# Altium project T1_Card.PrjPcb (part 5 of 6)

## Sheet T1_Data_Top_Level.SchDoc
size 431 x 279 mm; Date: Not shown in title block; ApprovedBy: Not shown in title block; CheckedBy: Not shown in title block; Author: Not shown in title block; CompanyName: Not shown in title block; DrawnBy: Andy Lin (TI); Engineer: Not shown in title block; Organization: Not shown in title block; Address1: Not shown in title block; Address2: Not shown in title block; Address3: Not shown in title block; Address4: Not shown in title block; DocumentNumber: 12; Revision: Use project parameter SCH_Rev; SheetNumber: 12; SheetTotal: 14; PageSetup: Record=PageOptions|CenterHorizontal=True|CenterVertical=True|PrintScale=1.00|XCorrection=1.00|YCorrection=1.00|PrintKind=0|BorderSize=5000000|LeftOffset=0|BottomOffset=0|Orientation=2|PaperLength=1000|PaperWidth=1000|Scale=100|PaperSource=15|PrintQuality=600|MediaType=1|DitherType=10|PaperKind=Letter|PrintScaleMode=1; CurrentTime: Not shown in title block; CurrentDate: Not shown in title block; Time: Not shown in title block; DocumentFullPathAndName: Not shown in title block; DocumentName: Not shown in title block; ModifiedDate: Not shown in title block; ImagePath: Not shown in title block
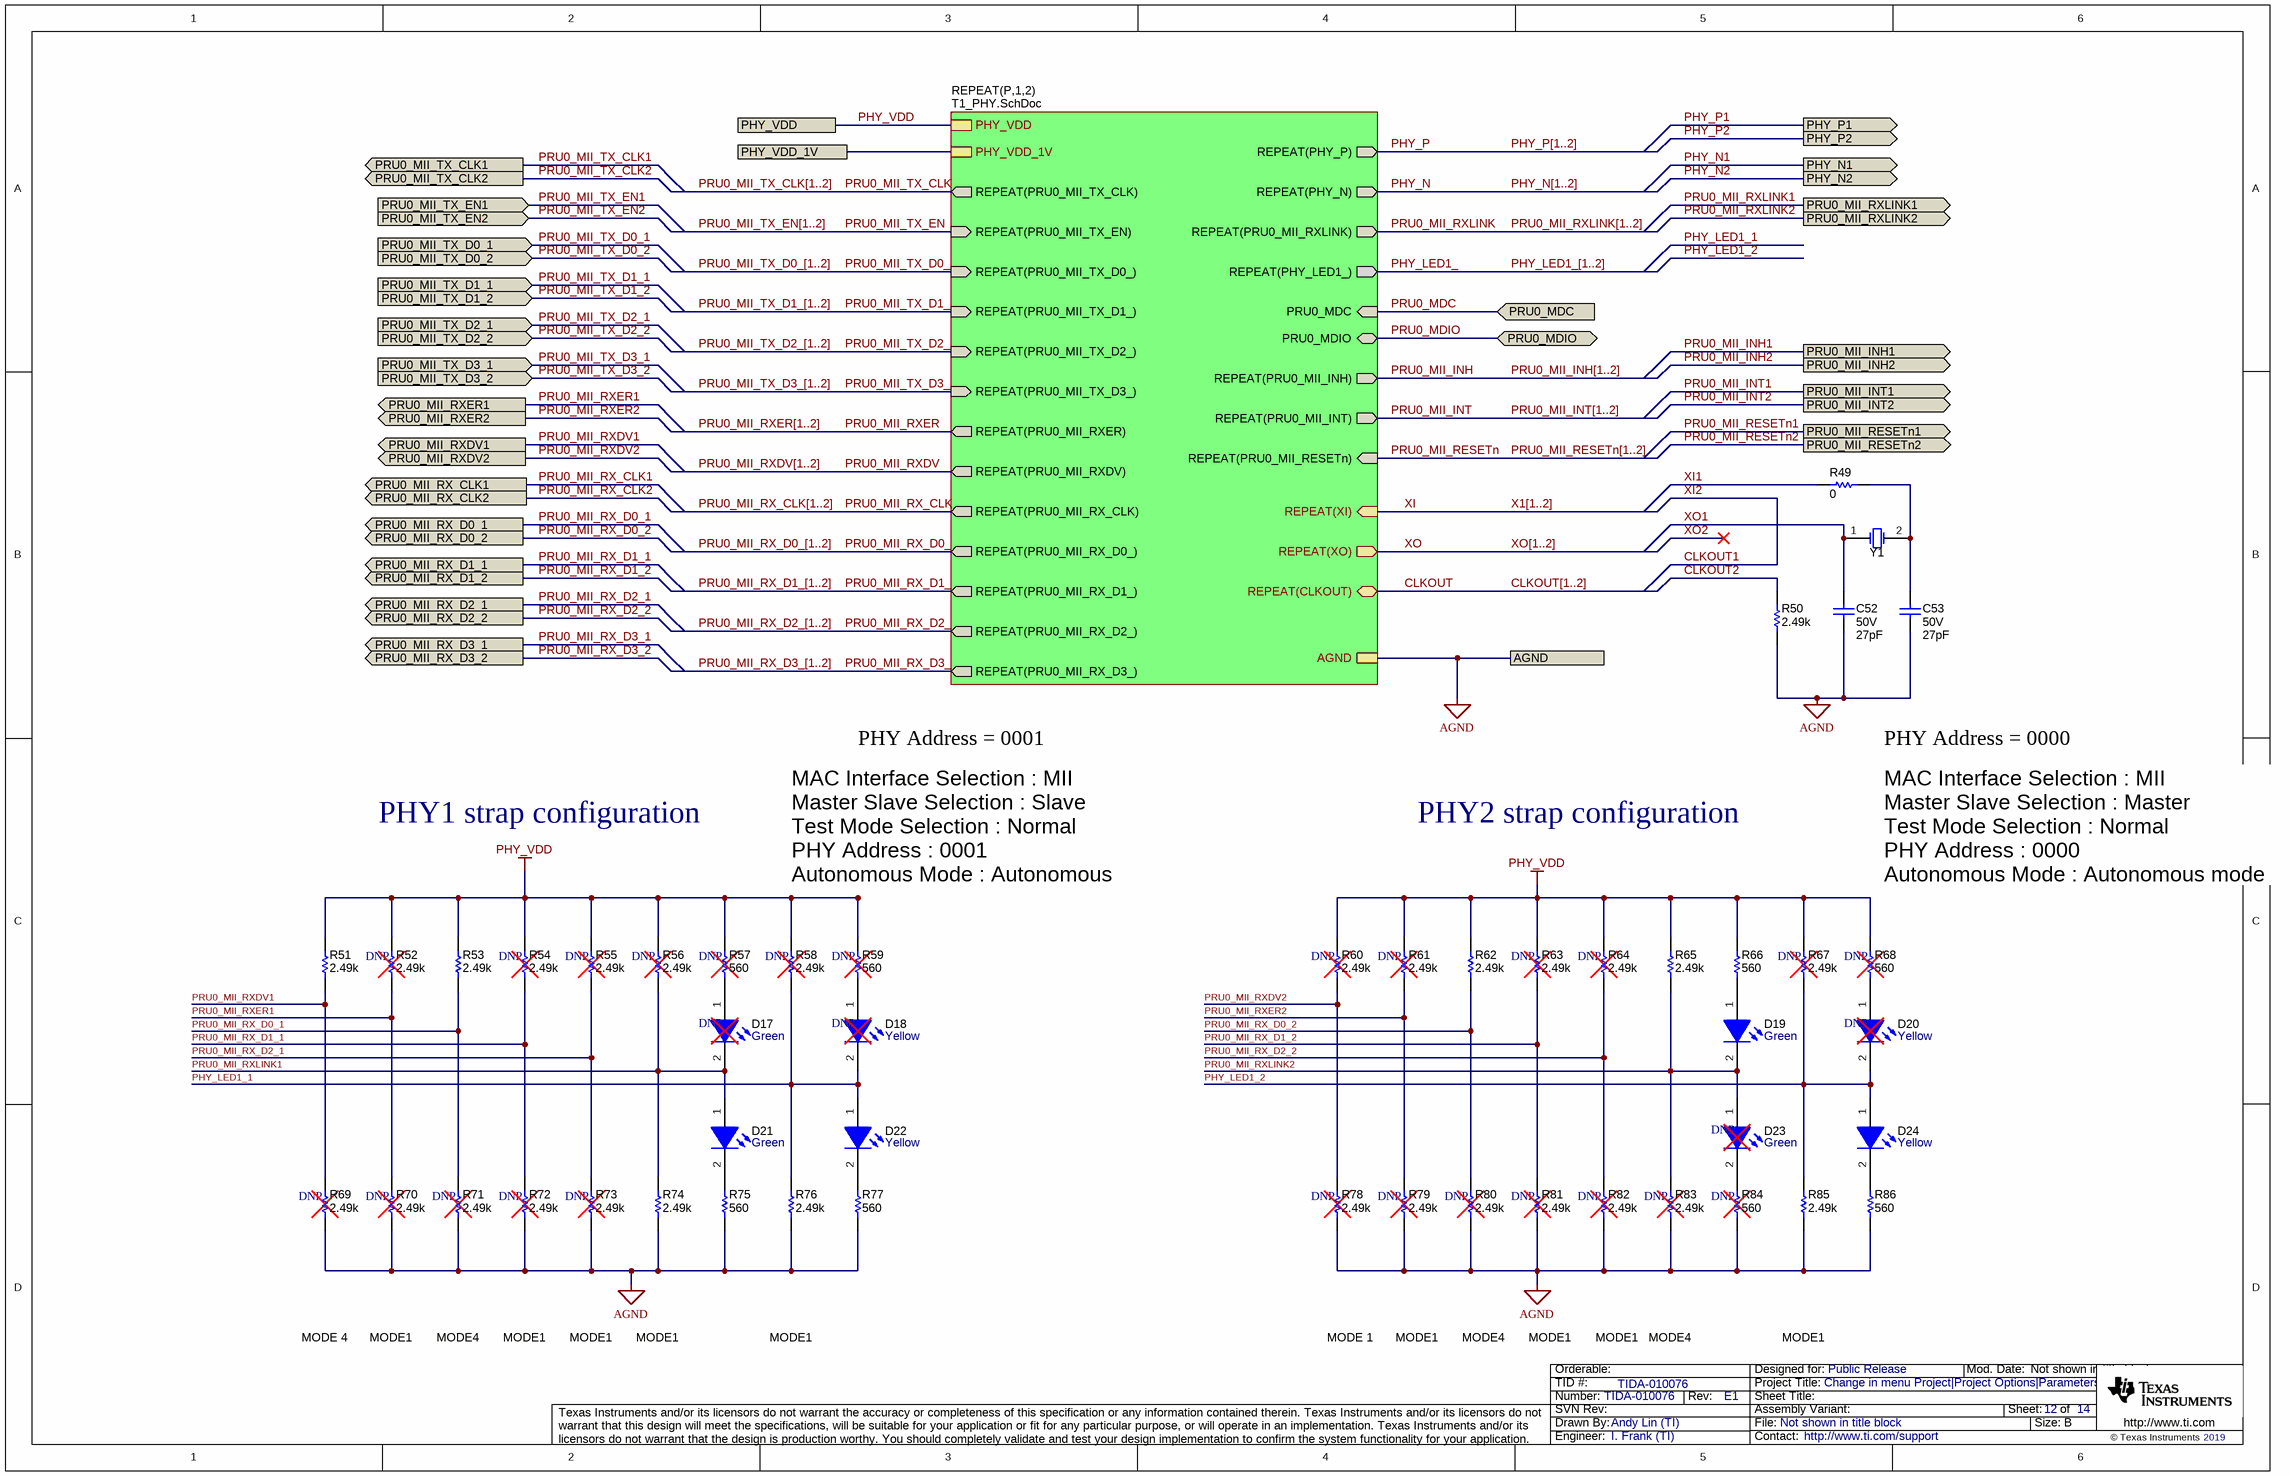
[diagram p11: T1_Data_Top_Level.SchDoc]

### Parts
C52  VDC_V: 50V  ValueDisplayed: 27pF  [0603]  (hidden comment: GRM1885C1H270JA01D)
C53  VDC_V: 50V  ValueDisplayed: 27pF  [0603]  (hidden comment: GRM1885C1H270JA01D)
D17  value Green  [LG L29K_GREEN]  (hidden comment: LG L29K-G2J1-24-Z)
D18  value Yellow  [LY L29K_Yellow]  (hidden comment: LY L29K-J1K2-26-Z)
D19  value Green  [LG L29K_GREEN]  (hidden comment: LG L29K-G2J1-24-Z)
D20  value Yellow  [LY L29K_Yellow]  (hidden comment: LY L29K-J1K2-26-Z)
D21  value Green  [LG L29K_GREEN]  (hidden comment: LG L29K-G2J1-24-Z)
D22  value Yellow  [LY L29K_Yellow]  (hidden comment: LY L29K-J1K2-26-Z)
D23  value Green  [LG L29K_GREEN]  (hidden comment: LG L29K-G2J1-24-Z)
D24  value Yellow  [LY L29K_Yellow]  (hidden comment: LY L29K-J1K2-26-Z)
R49  ValueDisplayed: 0  [0402]  (hidden comment: CRCW04020000Z0ED)
R50  ValueDisplayed: 2.49k  [0402]  (hidden comment: CRCW04022K49FKED)
R51  ValueDisplayed: 2.49k  [0402]  (hidden comment: CRCW04022K49FKED)
R52  ValueDisplayed: 2.49k  [0402]  (hidden comment: CRCW04022K49FKED)
R53  ValueDisplayed: 2.49k  [0402]  (hidden comment: CRCW04022K49FKED)
R54  ValueDisplayed: 2.49k  [0402]  (hidden comment: CRCW04022K49FKED)
R55  ValueDisplayed: 2.49k  [0402]  (hidden comment: CRCW04022K49FKED)
R56  ValueDisplayed: 2.49k  [0402]  (hidden comment: CRCW04022K49FKED)
R57  ValueDisplayed: 560  [0402]  (hidden comment: CRCW0402560RJNED)
R58  ValueDisplayed: 2.49k  [0402]  (hidden comment: CRCW04022K49FKED)
R59  ValueDisplayed: 560  [0402]  (hidden comment: CRCW0402560RJNED)
R60  ValueDisplayed: 2.49k  [0402]  (hidden comment: CRCW04022K49FKED)
R61  ValueDisplayed: 2.49k  [0402]  (hidden comment: CRCW04022K49FKED)
R62  ValueDisplayed: 2.49k  [0402]  (hidden comment: CRCW04022K49FKED)
R63  ValueDisplayed: 2.49k  [0402]  (hidden comment: CRCW04022K49FKED)
R64  ValueDisplayed: 2.49k  [0402]  (hidden comment: CRCW04022K49FKED)
R65  ValueDisplayed: 2.49k  [0402]  (hidden comment: CRCW04022K49FKED)
R66  ValueDisplayed: 560  [0402]  (hidden comment: CRCW0402560RJNED)
R67  ValueDisplayed: 2.49k  [0402]  (hidden comment: CRCW04022K49FKED)
R68  ValueDisplayed: 560  [0402]  (hidden comment: CRCW0402560RJNED)
R69  ValueDisplayed: 2.49k  [0402]  (hidden comment: CRCW04022K49FKED)
R70  ValueDisplayed: 2.49k  [0402]  (hidden comment: CRCW04022K49FKED)
R71  ValueDisplayed: 2.49k  [0402]  (hidden comment: CRCW04022K49FKED)
R72  ValueDisplayed: 2.49k  [0402]  (hidden comment: CRCW04022K49FKED)
R73  ValueDisplayed: 2.49k  [0402]  (hidden comment: CRCW04022K49FKED)
R74  ValueDisplayed: 2.49k  [0402]  (hidden comment: CRCW04022K49FKED)
R75  ValueDisplayed: 560  [0402]  (hidden comment: CRCW0402560RJNED)
R76  ValueDisplayed: 2.49k  [0402]  (hidden comment: CRCW04022K49FKED)
R77  ValueDisplayed: 560  [0402]  (hidden comment: CRCW0402560RJNED)
R78  ValueDisplayed: 2.49k  [0402]  (hidden comment: CRCW04022K49FKED)
R79  ValueDisplayed: 2.49k  [0402]  (hidden comment: CRCW04022K49FKED)
R80  ValueDisplayed: 2.49k  [0402]  (hidden comment: CRCW04022K49FKED)
R81  ValueDisplayed: 2.49k  [0402]  (hidden comment: CRCW04022K49FKED)
R82  ValueDisplayed: 2.49k  [0402]  (hidden comment: CRCW04022K49FKED)
R83  ValueDisplayed: 2.49k  [0402]  (hidden comment: CRCW04022K49FKED)
R84  ValueDisplayed: 560  [0402]  (hidden comment: CRCW0402560RJNED)
R85  ValueDisplayed: 2.49k  [0402]  (hidden comment: CRCW04022K49FKED)
R86  ValueDisplayed: 560  [0402]  (hidden comment: CRCW0402560RJNED)
Y1  ABM3-25.000MHZ-D2Y-T  [XTAL_ABM3]  (value not drawn)

### Sub-sheets
REPEAT(P,1,2) = T1_PHY.SchDoc: REPEAT(PRU0_MII_INH) (out), REPEAT(PRU0_MII_INT) (out), REPEAT(PRU0_MII_RESETn) (in), REPEAT(PRU0_MII_TX_CLK) (out), REPEAT(PRU0_MII_TX_EN) (in), REPEAT(PRU0_MII_TX_D0_) (in), REPEAT(PRU0_MII_TX_D1_) (in), REPEAT(PRU0_MII_TX_D2_) (in), REPEAT(PRU0_MII_TX_D3_) (in), REPEAT(PRU0_MII_RX_D0_) (out), REPEAT(PRU0_MII_RX_D1_) (out), REPEAT(PRU0_MII_RX_D2_) (out), REPEAT(PRU0_MII_RX_D3_) (out), REPEAT(PRU0_MII_RXER) (out), REPEAT(PRU0_MII_RXDV) (out), REPEAT(PRU0_MII_RX_CLK) (out), REPEAT(PRU0_MII_RXLINK) (out), PRU0_MDIO (bidir), PRU0_MDC (in), REPEAT(PHY_P) (out), REPEAT(PHY_N) (out), REPEAT(PHY_LED1_) (out), AGND, PHY_VDD, REPEAT(XO) (out), REPEAT(XI) (in), REPEAT(CLKOUT) (bidir), PHY_VDD_1V

### Ports
AGND, PHY_N1 (out), PHY_N2 (out), PHY_P1 (out), PHY_P2 (out), PHY_VDD, PHY_VDD_1V, PRU0_MDC (in), PRU0_MDIO (bidir), PRU0_MII_INH1 (out), PRU0_MII_INH2 (out), PRU0_MII_INT1 (out), PRU0_MII_INT2 (out), PRU0_MII_RESETn1 (out), PRU0_MII_RESETn2 (out), PRU0_MII_RX_CLK1 (out), PRU0_MII_RX_CLK2 (out), PRU0_MII_RX_D0_1 (out), PRU0_MII_RX_D0_2 (out), PRU0_MII_RX_D1_1 (out), PRU0_MII_RX_D1_2 (out), PRU0_MII_RX_D2_1 (out), PRU0_MII_RX_D2_2 (out), PRU0_MII_RX_D3_1 (out), PRU0_MII_RX_D3_2 (out), PRU0_MII_RXDV1 (out), PRU0_MII_RXDV2 (out), PRU0_MII_RXER1 (out), PRU0_MII_RXER2 (out), PRU0_MII_RXLINK1 (out), PRU0_MII_RXLINK2 (out), PRU0_MII_TX_CLK1 (out), PRU0_MII_TX_CLK2 (out), PRU0_MII_TX_D0_1 (in), PRU0_MII_TX_D0_2 (in), PRU0_MII_TX_D1_1 (in), PRU0_MII_TX_D1_2 (in), PRU0_MII_TX_D2_1 (in), PRU0_MII_TX_D2_2 (in), PRU0_MII_TX_D3_1 (in), PRU0_MII_TX_D3_2 (in), PRU0_MII_TX_EN1 (in), PRU0_MII_TX_EN2 (in)

### Nets
AGND: C52.2 C53.2 R50.1 R69.1 R70.1 R71.1 R72.1 R73.1 R74.1 R75.1 R76.1 R77.1 R78.1 R79.1 R80.1 R81.1 R82.1 R83.1 R84.1 R85.1 R86.1 ; port AGND, sheet REPEAT(P,1,2)/AGND
PHY_VDD: R51.2 R52.2 R53.2 R54.2 R55.2 R56.2 R57.2 R58.2 R59.2 R60.2 R61.2 R62.2 R63.2 R64.2 R65.2 R66.2 R67.2 R68.2 ; port PHY_VDD, sheet REPEAT(P,1,2)/PHY_VDD
CLKOUT: sheet REPEAT(P,1,2)/REPEAT(CLKOUT)
CLKOUT2: R50.2
PHY_LED1_: sheet REPEAT(P,1,2)/REPEAT(PHY_LED1_)
PHY_LED1_1: D18.2(K) D22.1(A) R58.1 R76.2
PHY_LED1_2: D20.2(K) D24.1(A) R67.1 R85.2
PHY_N: sheet REPEAT(P,1,2)/REPEAT(PHY_N)
PHY_N1: port PHY_N1
PHY_N2: port PHY_N2
PHY_P: sheet REPEAT(P,1,2)/REPEAT(PHY_P)
PHY_P1: port PHY_P1
PHY_P2: port PHY_P2
PHY_VDD_1V: port PHY_VDD_1V, sheet REPEAT(P,1,2)/PHY_VDD_1V
PRU0_MDC: port PRU0_MDC, sheet REPEAT(P,1,2)/PRU0_MDC
PRU0_MDIO: port PRU0_MDIO, sheet REPEAT(P,1,2)/PRU0_MDIO
PRU0_MII_INH: sheet REPEAT(P,1,2)/REPEAT(PRU0_MII_INH)
PRU0_MII_INH1: port PRU0_MII_INH1
PRU0_MII_INH2: port PRU0_MII_INH2
PRU0_MII_INT: sheet REPEAT(P,1,2)/REPEAT(PRU0_MII_INT)
PRU0_MII_INT1: port PRU0_MII_INT1
PRU0_MII_INT2: port PRU0_MII_INT2
PRU0_MII_RESETn: sheet REPEAT(P,1,2)/REPEAT(PRU0_MII_RESETn)
PRU0_MII_RESETn1: port PRU0_MII_RESETn1
PRU0_MII_RESETn2: port PRU0_MII_RESETn2
PRU0_MII_RX_CLK: sheet REPEAT(P,1,2)/REPEAT(PRU0_MII_RX_CLK)
PRU0_MII_RX_CLK1: port PRU0_MII_RX_CLK1
PRU0_MII_RX_CLK2: port PRU0_MII_RX_CLK2
PRU0_MII_RX_D0_: sheet REPEAT(P,1,2)/REPEAT(PRU0_MII_RX_D0_)
PRU0_MII_RX_D0_1: R53.1 R71.2 ; port PRU0_MII_RX_D0_1
PRU0_MII_RX_D0_2: R62.1 R80.2 ; port PRU0_MII_RX_D0_2
PRU0_MII_RX_D1_: sheet REPEAT(P,1,2)/REPEAT(PRU0_MII_RX_D1_)
PRU0_MII_RX_D1_1: R54.1 R72.2 ; port PRU0_MII_RX_D1_1
PRU0_MII_RX_D1_2: R63.1 R81.2 ; port PRU0_MII_RX_D1_2
PRU0_MII_RX_D2_: sheet REPEAT(P,1,2)/REPEAT(PRU0_MII_RX_D2_)
PRU0_MII_RX_D2_1: R55.1 R73.2 ; port PRU0_MII_RX_D2_1
PRU0_MII_RX_D2_2: R64.1 R82.2 ; port PRU0_MII_RX_D2_2
PRU0_MII_RX_D3_: sheet REPEAT(P,1,2)/REPEAT(PRU0_MII_RX_D3_)
PRU0_MII_RX_D3_1: port PRU0_MII_RX_D3_1
PRU0_MII_RX_D3_2: port PRU0_MII_RX_D3_2
PRU0_MII_RXDV: sheet REPEAT(P,1,2)/REPEAT(PRU0_MII_RXDV)
PRU0_MII_RXDV1: R51.1 R69.2 ; port PRU0_MII_RXDV1
PRU0_MII_RXDV2: R60.1 R78.2 ; port PRU0_MII_RXDV2
PRU0_MII_RXER: sheet REPEAT(P,1,2)/REPEAT(PRU0_MII_RXER)
PRU0_MII_RXER1: R52.1 R70.2 ; port PRU0_MII_RXER1
PRU0_MII_RXER2: R61.1 R79.2 ; port PRU0_MII_RXER2
PRU0_MII_RXLINK: sheet REPEAT(P,1,2)/REPEAT(PRU0_MII_RXLINK)
PRU0_MII_RXLINK1: D17.2(K) D21.1(A) R56.1 R74.2 ; port PRU0_MII_RXLINK1
PRU0_MII_RXLINK2: D19.2(K) D23.1(A) R65.1 R83.2 ; port PRU0_MII_RXLINK2
PRU0_MII_TX_CLK: sheet REPEAT(P,1,2)/REPEAT(PRU0_MII_TX_CLK)
PRU0_MII_TX_CLK1: port PRU0_MII_TX_CLK1
PRU0_MII_TX_CLK2: port PRU0_MII_TX_CLK2
PRU0_MII_TX_D0_: sheet REPEAT(P,1,2)/REPEAT(PRU0_MII_TX_D0_)
PRU0_MII_TX_D0_1: port PRU0_MII_TX_D0_1
PRU0_MII_TX_D0_2: port PRU0_MII_TX_D0_2
PRU0_MII_TX_D1_: sheet REPEAT(P,1,2)/REPEAT(PRU0_MII_TX_D1_)
PRU0_MII_TX_D1_1: port PRU0_MII_TX_D1_1
PRU0_MII_TX_D1_2: port PRU0_MII_TX_D1_2
PRU0_MII_TX_D2_: sheet REPEAT(P,1,2)/REPEAT(PRU0_MII_TX_D2_)
PRU0_MII_TX_D2_1: port PRU0_MII_TX_D2_1
PRU0_MII_TX_D2_2: port PRU0_MII_TX_D2_2
PRU0_MII_TX_D3_: sheet REPEAT(P,1,2)/REPEAT(PRU0_MII_TX_D3_)
PRU0_MII_TX_D3_1: port PRU0_MII_TX_D3_1
PRU0_MII_TX_D3_2: port PRU0_MII_TX_D3_2
PRU0_MII_TX_EN: sheet REPEAT(P,1,2)/REPEAT(PRU0_MII_TX_EN)
PRU0_MII_TX_EN1: port PRU0_MII_TX_EN1
PRU0_MII_TX_EN2: port PRU0_MII_TX_EN2
XI: sheet REPEAT(P,1,2)/REPEAT(XI)
XI1: R49.1
XO: sheet REPEAT(P,1,2)/REPEAT(XO)
XO1: C52.1 Y1.1(OSC1)
NetC53_1: C53.1 R49.2 Y1.2(OSC2)
NetD17_1: D17.1(A) R57.1
NetD18_1: D18.1(A) R59.1
NetD19_1: D19.1(A) R66.1
NetD20_1: D20.1(A) R68.1
NetD21_2: D21.2(K) R75.2
NetD22_2: D22.2(K) R77.2
NetD23_2: D23.2(K) R84.2
NetD24_2: D24.2(K) R86.2

### Buses and harness runs
bus CLKOUT[1..2]
bus PHY_LED1_[1..2]
bus PHY_N[1..2]
bus PHY_P[1..2]
bus PRU0_MII_INH[1..2]
bus PRU0_MII_INT[1..2]
bus PRU0_MII_RESETn[1..2]
bus PRU0_MII_RX_CLK[1..2]
bus PRU0_MII_RX_D0_[1..2]
bus PRU0_MII_RX_D1_[1..2]
bus PRU0_MII_RX_D2_[1..2]
bus PRU0_MII_RX_D3_[1..2]
bus PRU0_MII_RXDV[1..2]
bus PRU0_MII_RXER[1..2]
bus PRU0_MII_RXLINK[1..2]
bus PRU0_MII_TX_CLK[1..2]
bus PRU0_MII_TX_D0_[1..2]
bus PRU0_MII_TX_D1_[1..2]
bus PRU0_MII_TX_D2_[1..2]
bus PRU0_MII_TX_D3_[1..2]
bus PRU0_MII_TX_EN[1..2]
bus X1[1..2]
bus XO[1..2]

### Notes on the sheet
- PHY1 strap configuration
- PHY2 strap configuration
- MAC Interface Selection : MII
  Master Slave Selection : Slave
  Test Mode Selection : Normal
  PHY Address : 0001
  Autonomous Mode : Autonomous mode
- MAC Interface Selection : MII
  Master Slave Selection : Master
  Test Mode Selection : Normal
  PHY Address : 0000
  Autonomous Mode : Autonomous mode
- (near R52) DNP
- (near R54) DNP
- (near R55) DNP
- (near R56) DNP
- (near R57) DNP
- (near R58) DNP
- (near R59) DNP
- (near R60) DNP
- (near R61) DNP
- (near R63) DNP
- (near R64) DNP
- (near R67) DNP
- (near R68) DNP
- (near D17) DNP
- (near D18) DNP
- (near D20) DNP
- (near D23) DNP
- (near R69) DNP
- (near R70) DNP
- (near R71) DNP
- (near R72) DNP
- (near R73) DNP
- (near R78) DNP
- (near R79) DNP
- (near R80) DNP
- (near R81) DNP
- (near R82) DNP
- (near R83) DNP
- (near R84) DNP
- MODE 4
- MODE1
- MODE4
- MODE 1
- Labels drawn without touching a wire or pin: PHY Address = 0000, PHY Address = 0001
- Drawn By:
- SVN Rev:
- Number:
- TID #:
- Orderable:
- Rev:
- Sheet Title:
- File:
- Project Title:
- Designed for:
- Assembly Variant:
- Mod. Date:
- Sheet:
- Size:
- of
- B
- http://www.ti.com
- Texas Instruments and/or its licensors do not warrant the accuracy or completeness of this specification or any information contained therein. Texas Instruments and/or its licensors do not warrant that this design will meet the specifications, will be suitable for your application or fit for any particular purpose, or will operate in an implementation. Texas Instruments and/or its licensors do not warrant that the design is production worthy. You should completely validate and test your design implementation to confirm the system functionality for your application.
- Engineer:
- Contact:
- © Texas Instruments

### Library data of the parts
C52 C53 = CMP-0007202-4: CAP, CERM, 27 pF, 50 V, +/- 5%, C0G/NP0, 0603; Manufacturer: MuRata; TaMin_C: -55°C; Polarized: N; SizeAreaWB_mm2: 4.68; Value1: Unknown; U/M: EA; Value: 27pF; TaMax_C: 125°C; SizeZ_mm: 1; SizeX_mm: 1.6; SizeY_mm: 0.8; SizeArea_mm2: 1.28; AEC Category: Q200; Supplier Part Number 2: 81-GRM1885C1H270JA01; Publisher: Texas Instruments; Supplier 2: Mouser; Supplier Part Number 3: 1828909; TempCo: C0G/NP0; Supplier 3: Farnell; Published: 2008-06-19; RoHS: Y; MountType: SMT; Supplier 1: Digi-Key; PackageReference: 0603; Tolerance_%: 5%; Cap_Case: 0603; Value2: 50V; CompType: Capacitor; LatestRevisionDate: 2017-03-09; PartNumber: GRM1885C1H270JA01D; AEC Qualified: ?; Cap_F: 27pF; ComponentLink1Description: Datasheet link; Supplier Part Number 1: 490-1413-1-ND; Technology: Ceramic; ComponentLink1URL: http://search.murata.co.jp/Ceramy/PnsearchViewAction.do?HnOFG=ON&HnNFG=ON&SEL_CNT=50&sLang=en&sKey=GRM1885C1H270JA01D&x=9&y=9&search=startwith
D17 D19 D21 D23 = CMP-0002874-2: LED, Green, SMD; Manufacturer: OSRAM; Io_A: 2mA; Value2: 1.7V; Value1: W; Tjmax_C: 110°C; RoHS: Y; PartNumber: LG L29K-G2J1-24-Z; Color: green; Type: ?; PackageReference: 1.7x0.65x0.8mm; ComponentLink1URL: http://www.osram-os.com/Graphics/XPic2/00077107_0.pdf; ComponentLink1Description: Datasheet link; Vf_V: 1.7V; CompType: LED; MountType: SMT
D18 D20 D22 D24 = CMP-0002875-2: LED, Yellow, SMD; Manufacturer: OSRAM; Tjmax_C: 110°C; Value1: W; Value2: 1.8V; Io_A: 2mA; RoHS: Y; PackageReference: LED, 1.3x0.65x0.8mm; ComponentLink1URL: http://www.osram-os.com/Graphics/XPic1/00077106_0.pdf/LY%20%20%20%20%20%20L29K%20-%20SMARTLED%200603.pdf; CompType: LED; PartNumber: LY L29K-J1K2-26-Z; Color: yellow; Type: ?; Vf_V: 1.8V; ComponentLink1Description: Datasheet link; MountType: SMT
R49 = CMP-0026822-2: RES, 0, 5%, 0.063 W, 0402; Manufacturer: Vishay-Dale; Power_W: 63mW; TempCo: 200 ppm/C; Value_Code: 0000; U/M: EA; Value: 0; EIA_Code: E24; SizeX_mm: 1; SizeY_mm: 0.5; SizeZ_mm: 0.6; Value2: 0.063W; VDC_V: 50V; AEC Category: Q200; Supplier Part Number 2: 52K6543; Publisher: Texas Instruments; Supplier 2: Newark; Supplier Part Number 3: 71-CRCW0402-0-E3; Supplier 3: Mouser; Published: 2008-06-26; RoHS: Y; Value1: 5%; MountType: SMT; Supplier 1: Digi-Key; PackageReference: 0402; Tolerance_%: 5%; Res_ohm: 0; SizeArea_mm2: 0.5; CompType: Resistor; LatestRevisionDate: 2017-03-09; PartNumber: CRCW04020000Z0ED; AEC Qualified: ?; ComponentLink1Description: Datasheet link; Supplier Part Number 1: 541-0.0JCT-ND; Technology: Thick Film; ComponentLink1URL: http://www.vishay.com/docs/20035/dcrcwe3.pdf
R50-R56 R58 R60-R65 R67 R69-R74 R76 R78-R83 R85 = CMP-0026237-2: RES, 2.49 k, 1%, 0.063 W, AEC-Q200 Grade 0, 0402; Manufacturer: Vishay-Dale; Power_W: 63mW; TempCo: 100 ppm/C; Value_Code: 2k49; Value: 2.49k; EIA_Code: E96; SizeX_mm: 1; SizeY_mm: 0.5; SizeZ_mm: 0.6; Value2: 0.063W; AEC Qualified: Y; VDC_V: 50V; AEC Category: Q200; AEC Grade: 0; ComponentLink1URL: http://www.vishay.com/docs/20035/dcrcwe3.pdf; Supplier Part Number 2: 52K6803; Supplier 2: Newark; Supplier Part Number 3: 71-CRCW0402-2.49K-E3; Supplier 3: Mouser; RoHS: E; Value1: 1%; MountType: SMT; Supplier 1: Digi-Key; PackageReference: 0402; Tolerance_%: 1%; Res_ohm: 2.49k; SizeArea_mm2: 0.5; CompType: Resistor; PartNumber: CRCW04022K49FKED; ComponentLink1Description: Datasheet link; Supplier Part Number 1: 541-2.49KLCT-ND; Technology: Thick Film
R57 R59 R66 R68 R75 R77 R84 R86 = CMP-0026948-3: RES, 560, 5%, 0.063 W, AEC-Q200 Grade 0, 0402; Manufacturer: Vishay-Dale; Power_W: 63mW; TempCo: 200 ppm/C; Value_Code: 560R; Value: 560; EIA_Code: E24; SizeX_mm: 1; SizeY_mm: 0.5; SizeZ_mm: 0.6; Value2: 0.063W; AEC Qualified: Y; VDC_V: 50V; AEC Category: Q200; AEC Grade: 0; Supplier Part Number 2: 59M6740; Supplier 2: Newark; Supplier Part Number 3: 71-CRCW0402J-560-E3; Supplier 3: Mouser; RoHS: E; Value1: 5%; MountType: SMT; Supplier 1: Digi-Key; PackageReference: 0402; Tolerance_%: 5%; Res_ohm: 560; SizeArea_mm2: 0.5; CompType: Resistor; PartNumber: CRCW0402560RJNED; ComponentLink1Description: Datasheet link; Supplier Part Number 1: 541-560JCT-ND; Technology: Thick Film; ComponentLink1URL: http://www.vishay.com/docs/20035/dcrcwe3.pdf
Y1 = CMP-0004620-3: Crystal, 25 MHz, 18 pF, SMD; Manufacturer: Abracon Corporation; TaMin_C: -40°C; Frequency Stability: +/-30ppm; Frequency_Fixed: 25MHz; TaMax_C: 85°C; Supplier Part Number 2: 77R1477; Supplier 2: Newark; Supplier Part Number 3: 815-ABM3-25-D2Y-T; Supplier 3: Mouser; RoHS: E; MountType: SMT; Supplier 1: Digi-Key; PackageReference: ABM3; CompType: Crystal; PartNumber: ABM3-25.000MHZ-D2Y-T; ComponentLink1Description: Datasheet Link; Supplier Part Number 1: 535-10645-1-ND; ComponentLink1URL: http://www.abracon.com/Resonators/abm3.pdf; REACh: Y

## Sheet T1_PHY.SchDoc
size 431 x 279 mm; Date: Not shown in title block; ApprovedBy: Not shown in title block; CheckedBy: Not shown in title block; Author: Not shown in title block; CompanyName: Not shown in title block; DrawnBy: Andy Lin (TI); Engineer: Not shown in title block; Organization: Not shown in title block; Address1: Not shown in title block; Address2: Not shown in title block; Address3: Not shown in title block; Address4: Not shown in title block; DocumentNumber: 13; Revision: Use project parameter SCH_Rev; SheetNumber: 13; SheetTotal: 14; PageSetup: Record=PageOptions|CenterHorizontal=True|CenterVertical=True|PrintScale=1.00|XCorrection=1.00|YCorrection=1.00|PrintKind=0|BorderSize=5000000|LeftOffset=0|BottomOffset=0|Orientation=2|PaperLength=1000|PaperWidth=1000|Scale=100|PaperSource=15|PrintQuality=600|MediaType=1|DitherType=10|PaperKind=Letter|PrintScaleMode=1; CurrentTime: Not shown in title block; CurrentDate: Not shown in title block; Time: Not shown in title block; DocumentFullPathAndName: Not shown in title block; DocumentName: Not shown in title block; ModifiedDate: Not shown in title block; ImagePath: Not shown in title block
Used 2 times, as channels U_T1_Card_Top/U_T1_Data_Top_Level/P1, U_T1_Card_Top/U_T1_Data_Top_Level/P2. Parts and nets are listed once, with the designators drawn on the sheet.
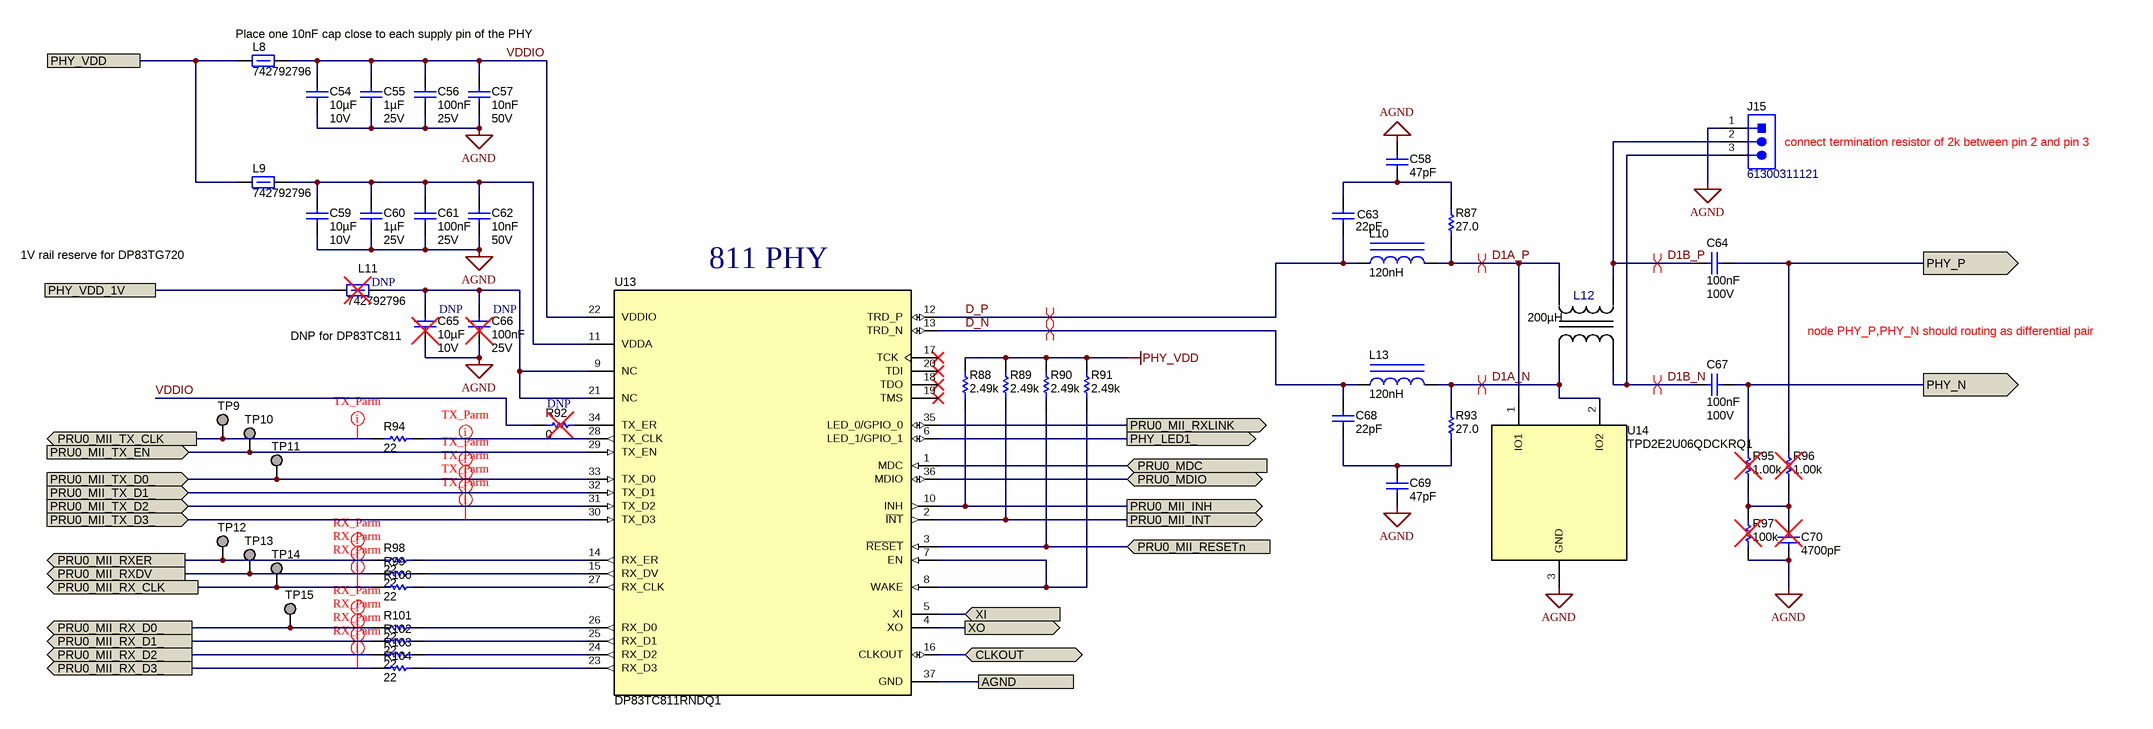
[diagram p12: T1_PHY.SchDoc]

### Parts
C54  Cap_F: 10µF  VDC_V: 10V  [0603]  (hidden comment: GRM188Z71A106MA73D)
C55  Cap_F: 1µF  VDC_V: 25V  [0603]  (hidden comment: GCM188R71E105KA64D)
C56  Cap_F: 100nF  VDC_V: 25V  [0603]  (hidden comment: GRM188R71E104KA01D)
C57  Cap_F: 10nF  VDC_V: 50V  [0603]  (hidden comment: GCM188R71H103KA37D)
C58  ValueDisplayed: 47pF  [0603]  (hidden comment: CGA3E2C0G1H470J080AA)
C59  Cap_F: 10µF  VDC_V: 10V  [0603]  (hidden comment: GRM188Z71A106MA73D)
C60  Cap_F: 1µF  VDC_V: 25V  [0603]  (hidden comment: GCM188R71E105KA64D)
C61  Cap_F: 100nF  VDC_V: 25V  [0603]  (hidden comment: GRM188R71E104KA01D)
C62  Cap_F: 10nF  VDC_V: 50V  [0603]  (hidden comment: GCM188R71H103KA37D)
C63  ValueDisplayed: 22pF  [0603]  (hidden comment: GRM1885C2A220JA01D)
C64  Cap_F: 100nF  VDC_V: 100V  [0603]  (hidden comment: GRM188R72A104KA35J)
C65  Cap_F: 10µF  VDC_V: 10V  [0603]  (hidden comment: GRM188Z71A106MA73D)
C66  Cap_F: 100nF  VDC_V: 25V  [0603]  (hidden comment: GRM188R71E104KA01D)
C67  Cap_F: 100nF  VDC_V: 100V  [0603]  (hidden comment: GRM188R72A104KA35J)
C68  ValueDisplayed: 22pF  [0603]  (hidden comment: GRM1885C2A220JA01D)
C69  ValueDisplayed: 47pF  [0603]  (hidden comment: CGA3E2C0G1H470J080AA)
C70  ValueDisplayed: 4700pF  [0603]  (hidden comment: GCM188R72A472KA37D)
J15  61300311121  [WURTH_61300311121]
L8  742792796  [0402]
L9  742792796  [0402]
L10  ValueDisplayed: 120nH  [IND_LQG15H]  (hidden comment: LQG15HSR12J02D)
L11  742792796  [0402]
L12  DLW32MH201XK2  [FP-DLW32MH201XK2_1210-MFG]  (value not drawn)
L13  ValueDisplayed: 120nH  [IND_LQG15H]  (hidden comment: LQG15HSR12J02D)
R87  ValueDisplayed: 27.0  [0603]  (hidden comment: RC0603FR-0727RL)
R88  ValueDisplayed: 2.49k  [0402]  (hidden comment: CRCW04022K49FKED)
R89  ValueDisplayed: 2.49k  [0402]  (hidden comment: CRCW04022K49FKED)
R90  ValueDisplayed: 2.49k  [0402]  (hidden comment: CRCW04022K49FKED)
R91  ValueDisplayed: 2.49k  [0402]  (hidden comment: CRCW04022K49FKED)
R92  ValueDisplayed: 0  [0402]  (hidden comment: CRCW04020000Z0ED)
R93  ValueDisplayed: 27.0  [0603]  (hidden comment: RC0603FR-0727RL)
R94  ValueDisplayed: 22  [0402]  (hidden comment: CRCW040222R0JNED)
R95  ValueDisplayed: 1.00k  [0603]  (hidden comment: CRCW06031K00FKEA)
R96  ValueDisplayed: 1.00k  [0603]  (hidden comment: CRCW06031K00FKEA)
R97  ValueDisplayed: 100k  [1206]  (hidden comment: CRCW1206100KFKEA)
R98  ValueDisplayed: 22  [0402]  (hidden comment: CRCW040222R0JNED)
R99  ValueDisplayed: 22  [0402]  (hidden comment: CRCW040222R0JNED)
R100  ValueDisplayed: 22  [0402]  (hidden comment: CRCW040222R0JNED)
R101  ValueDisplayed: 22  [0402]  (hidden comment: CRCW040222R0JNED)
R102  ValueDisplayed: 22  [0402]  (hidden comment: CRCW040222R0JNED)
R103  ValueDisplayed: 22  [0402]  (hidden comment: CRCW040222R0JNED)
R104  ValueDisplayed: 22  [0402]  (hidden comment: CRCW040222R0JNED)
TP9  TESTPOINT123  [TP_VIA_018RND008]  (value not drawn)  (no BOM)
TP10  TESTPOINT123  [TP_VIA_018RND008]  (value not drawn)  (no BOM)
TP11  TESTPOINT123  [TP_VIA_018RND008]  (value not drawn)  (no BOM)
TP12  TESTPOINT123  [TP_VIA_018RND008]  (value not drawn)  (no BOM)
TP13  TESTPOINT123  [TP_VIA_018RND008]  (value not drawn)  (no BOM)
TP14  TESTPOINT123  [TP_VIA_018RND008]  (value not drawn)  (no BOM)
TP15  TESTPOINT123  [TP_VIA_018RND008]  (value not drawn)  (no BOM)
U13  DP83TC811RNDQ1  [RND0036A]
U14  TPD2E2U06QDCKRQ1  [DCK0003A_N]

### Ports
AGND, CLKOUT (bidir), PHY_LED1_ (out), PHY_N (out), PHY_P (out), PHY_VDD, PHY_VDD_1V, PRU0_MDC (in), PRU0_MDIO (bidir), PRU0_MII_INH (out), PRU0_MII_INT (out), PRU0_MII_RESETn (in), PRU0_MII_RX_CLK (out), PRU0_MII_RX_D0_ (out), PRU0_MII_RX_D1_ (out), PRU0_MII_RX_D2_ (out), PRU0_MII_RX_D3_ (out), PRU0_MII_RXDV (out), PRU0_MII_RXER (out), PRU0_MII_RXLINK (out), PRU0_MII_TX_CLK (out), PRU0_MII_TX_D0_ (in), PRU0_MII_TX_D1_ (in), PRU0_MII_TX_D2_ (in), PRU0_MII_TX_D3_ (in), PRU0_MII_TX_EN (in), XI (in), XO (out)

### Nets
AGND: C54.2 C55.2 C56.2 C57.2 C58.1 C59.2 C60.2 C61.2 C62.2 C65.2 C66.2 C69.2 C70.2 J15.1 R97.1 U14.3(GND)
PHY_VDD: R88.2 R89.2 R90.2 R91.2
AGND: U13.37(GND) ; port AGND  [a separate net that carries the same name]
CLKOUT: U13.16(CLKOUT) ; port CLKOUT
D1A_N: L12.4 L13.2 R93.2 U14.2(IO2)
D1A_P: L10.2 L12.1 R87.1 U14.1(IO1)
D1B_N: C67.2 J15.3 L12.3
D1B_P: C64.2 J15.2 L12.2
D_N: C68.1 L13.1 U13.13(TRD_N)
D_P: C63.2 L10.1 U13.12(TRD_P)
PHY_LED1_: U13.6(LED_1/GPIO_1) ; port PHY_LED1_
PHY_N: C67.1 R95.2 ; port PHY_N
PHY_P: C64.1 R96.2 ; port PHY_P
PHY_VDD: L8.1 L9.1 ; port PHY_VDD  [a separate net that carries the same name]
PHY_VDD_1V: L11.1 ; port PHY_VDD_1V
PRU0_MDC: U13.1(MDC) ; port PRU0_MDC
PRU0_MDIO: U13.36(MDIO) ; port PRU0_MDIO
PRU0_MII_INH: R88.1 U13.10(INH) ; port PRU0_MII_INH
PRU0_MII_INT: R89.1 U13.2(~{INT}) ; port PRU0_MII_INT
PRU0_MII_RESETn: R90.1 U13.3(~{RESET}) ; port PRU0_MII_RESETn
PRU0_MII_RX_CLK: R100.1 TP14.1 ; port PRU0_MII_RX_CLK
PRU0_MII_RX_D0_: R101.1 TP15.1 ; port PRU0_MII_RX_D0_
PRU0_MII_RX_D1_: R102.1 ; port PRU0_MII_RX_D1_
PRU0_MII_RX_D2_: R103.1 ; port PRU0_MII_RX_D2_
PRU0_MII_RX_D3_: R104.1 ; port PRU0_MII_RX_D3_
PRU0_MII_RXDV: R99.1 TP13.1 ; port PRU0_MII_RXDV
PRU0_MII_RXER: R98.1 TP12.1 ; port PRU0_MII_RXER
PRU0_MII_RXLINK: U13.35(LED_0/GPIO_0) ; port PRU0_MII_RXLINK
PRU0_MII_TX_CLK: R94.1 TP9.1 ; port PRU0_MII_TX_CLK
PRU0_MII_TX_D0_: TP11.1 U13.33(TX_D0) ; port PRU0_MII_TX_D0_
PRU0_MII_TX_D1_: U13.32(TX_D1) ; port PRU0_MII_TX_D1_
PRU0_MII_TX_D2_: U13.31(TX_D2) ; port PRU0_MII_TX_D2_
PRU0_MII_TX_D3_: U13.30(TX_D3) ; port PRU0_MII_TX_D3_
PRU0_MII_TX_EN: TP10.1 U13.29(TX_EN) ; port PRU0_MII_TX_EN
VDDIO: C54.1 C55.1 C56.1 C57.1 L8.2 R92.1 U13.22(VDDIO)
XI: U13.5(XI) ; port XI
XO: U13.4(XO) ; port XO
NetC58_2: C58.2 C63.1 R87.2
NetC59_1: C59.1 C60.1 C61.1 C62.1 L9.2 U13.11(VDDA)
NetC65_1: C65.1 C66.1 L11.2 U13.9(NC) U13.21(NC)
NetC68_2: C68.2 C69.1 R93.1
NetC70_1: C70.1 R95.1 R96.1 R97.2
NetR91_1: R91.1 U13.7(EN) U13.8(WAKE)
NetR92_2: R92.2 U13.34(TX_ER)
NetR94_2: R94.2 U13.28(TX_CLK)
NetR98_2: R98.2 U13.14(RX_ER)
NetR99_2: R99.2 U13.15(RX_DV)
NetR100_2: R100.2 U13.27(RX_CLK)
NetR101_2: R101.2 U13.26(RX_D0)
NetR102_2: R102.2 U13.25(RX_D1)
NetR103_2: R103.2 U13.24(RX_D2)
NetR104_2: R104.2 U13.23(RX_D3)

Not connected (* = marked no-connect by the designer): U13 17(TCK)* 18(TDO)* 19(TMS)* 20(TDI)*

### Channels
U_T1_Card_Top/U_T1_Data_Top_Level/P1: designators end in _P1; ports AGND=AGND CLKOUT=CLKOUT PHY_LED1_=PHY_LED1_ PHY_N=PHY_N PHY_P=PHY_P PHY_VDD=PHY_VDD PHY_VDD_1V=PHY_VDD_1V PRU0_MDC=PRU0_MDC PRU0_MDIO=PRU0_MDIO PRU0_MII_INH=PRU0_MII_INH PRU0_MII_INT=PRU0_MII_INT PRU0_MII_RESETn=PRU0_MII_RESETn PRU0_MII_RX_CLK=PRU0_MII_RX_CLK PRU0_MII_RX_D0_=PRU0_MII_RX_D0_ PRU0_MII_RX_D1_=PRU0_MII_RX_D1_ PRU0_MII_RX_D2_=PRU0_MII_RX_D2_ PRU0_MII_RX_D3_=PRU0_MII_RX_D3_ PRU0_MII_RXDV=PRU0_MII_RXDV PRU0_MII_RXER=PRU0_MII_RXER PRU0_MII_RXLINK=PRU0_MII_RXLINK PRU0_MII_TX_CLK=PRU0_MII_TX_CLK PRU0_MII_TX_D0_=PRU0_MII_TX_D0_ PRU0_MII_TX_D1_=PRU0_MII_TX_D1_ PRU0_MII_TX_D2_=PRU0_MII_TX_D2_ PRU0_MII_TX_D3_=PRU0_MII_TX_D3_ PRU0_MII_TX_EN=PRU0_MII_TX_EN XI=XI XO=XO
U_T1_Card_Top/U_T1_Data_Top_Level/P2: designators end in _P2; ports AGND=AGND CLKOUT=CLKOUT PHY_LED1_=PHY_LED1_ PHY_N=PHY_N PHY_P=PHY_P PHY_VDD=PHY_VDD PHY_VDD_1V=PHY_VDD_1V PRU0_MDC=PRU0_MDC PRU0_MDIO=PRU0_MDIO PRU0_MII_INH=PRU0_MII_INH PRU0_MII_INT=PRU0_MII_INT PRU0_MII_RESETn=PRU0_MII_RESETn PRU0_MII_RX_CLK=PRU0_MII_RX_CLK PRU0_MII_RX_D0_=PRU0_MII_RX_D0_ PRU0_MII_RX_D1_=PRU0_MII_RX_D1_ PRU0_MII_RX_D2_=PRU0_MII_RX_D2_ PRU0_MII_RX_D3_=PRU0_MII_RX_D3_ PRU0_MII_RXDV=PRU0_MII_RXDV PRU0_MII_RXER=PRU0_MII_RXER PRU0_MII_RXLINK=PRU0_MII_RXLINK PRU0_MII_TX_CLK=PRU0_MII_TX_CLK PRU0_MII_TX_D0_=PRU0_MII_TX_D0_ PRU0_MII_TX_D1_=PRU0_MII_TX_D1_ PRU0_MII_TX_D2_=PRU0_MII_TX_D2_ PRU0_MII_TX_D3_=PRU0_MII_TX_D3_ PRU0_MII_TX_EN=PRU0_MII_TX_EN XI=XI XO=XO

### Layout directives
differential pair: D1A_N_P1, D1A_P_P1, D1B_N_P1, D1B_P_P1, D_N_P1, D_P_P1
net class TX_MII: PRU0_MII_TX_CLK, PRU0_MII_TX_D0_, PRU0_MII_TX_D1_, PRU0_MII_TX_D2_, PRU0_MII_TX_D3_, PRU0_MII_TX_EN
net class RX_MII: PRU0_MII_RX_CLK, PRU0_MII_RX_D0_, PRU0_MII_RX_D1_, PRU0_MII_RX_D2_, PRU0_MII_RX_D3_, PRU0_MII_RXDV, PRU0_MII_RXER

### Notes on the sheet
- (near L8) Place one 10nF cap close to each supply pin of the PHY
- (near J15) connect termination resistor of 2k between pin 2 and pin 3
- 1V rail reserve for DP83TG720
- (near L11) DNP
- DNP
- (near C66) DNP
- (near U13) 811 PHY
- (near L12) 200µH
- DNP for DP83TC811
- node PHY_P,PHY_N should routing as differential pair
- (near R92) DNP
- Drawn By:
- SVN Rev:
- Number:
- TID #:
- Orderable:
- Rev:
- Sheet Title:
- File:
- Project Title:
- Designed for:
- Assembly Variant:
- Mod. Date:
- Sheet:
- Size:
- of
- B
- http://www.ti.com
- Texas Instruments and/or its licensors do not warrant the accuracy or completeness of this specification or any information contained therein. Texas Instruments and/or its licensors do not warrant that this design will meet the specifications, will be suitable for your application or fit for any particular purpose, or will operate in an implementation. Texas Instruments and/or its licensors do not warrant that the design is production worthy. You should completely validate and test your design implementation to confirm the system functionality for your application.
- Engineer:
- Contact:
- © Texas Instruments

### Library data of the parts
C54 C59 C65 = CMP-0007497-5: as C47 on sheet LP2951; Publisher: Texas Instruments; TempCo: X7R; Published: 2008-06-19; RoHS: Y; MountType: SMT; Supplier 1: Mouser; PackageReference: 0603; Tolerance_%: 20%; Cap_Case: 0603; Value2: 10V; CompType: Capacitor; LatestRevisionDate: 2017-03-09; PartNumber: GRM188Z71A106MA73D; AEC Qualified: N; ComponentLink1Description: Datasheet link; AEC Grade: N/A; Supplier Part Number 1: 81-GRM188Z71A106MA3D; Technology: Ceramic; ValueDisplayed: 10uF; ComponentLink1URL: http://psearch.en.murata.com/capacitor/product/GRM188Z71A106MA73%23.pdf
C55 C60 = CMP-0007139-4: CAP, CERM, 1 uF, 25 V, +/- 10%, X7R, AEC-Q200 Grade 1, 0603; Manufacturer: MuRata; TaMin_C: -55°C; Polarized: N; SizeAreaWB_mm2: 4.68; Value1: Unknown; U/M: EA; Value: 1uF; TaMax_C: 125°C; SizeZ_mm: 1; SizeX_mm: 1.6; SizeY_mm: 0.8; SizeArea_mm2: 1.28; AEC Qualified: Y; AEC Category: Q200; Supplier Part Number 2: 45Y5164; Publisher: Texas Instruments; Supplier 2: Newark; Supplier Part Number 3: 81-GCM188R71E105KA4D; TempCo: X7R; Supplier 3: Mouser; Published: 2008-06-19; RoHS: Y; MountType: SMT; Supplier 1: Digi-Key; PackageReference: 0603; Tolerance_%: 10%; Cap_Case: 0603; Value2: 25V; CompType: Capacitor; LatestRevisionDate: 2017-03-09; PartNumber: GCM188R71E105KA64D; ComponentLink1Description: Datasheet link; AEC Grade: 1; Supplier Part Number 1: 490-10673-1-ND; Technology: Ceramic; ValueDisplayed: 1uF; ComponentLink1URL: http://psearch.en.murata.com/capacitor/product/GCM188R71E105KA64%23.pdf
C56 C61 C66 = CMP-0007404-4: CAP, CERM, 0.1 uF, 25 V, +/- 10%, X7R, 0603; Manufacturer: MuRata; TaMin_C: -55°C; Polarized: N; SizeAreaWB_mm2: 4.68; Value1: Unknown; U/M: EA; Value: 0.1uF; TaMax_C: 125°C; SizeZ_mm: 1; SizeX_mm: 1.6; SizeY_mm: 0.8; SizeArea_mm2: 1.28; AEC Category: Q200; Supplier Part Number 2: 81-GRM39X104K25; Publisher: Texas Instruments; Supplier 2: Mouser; Supplier Part Number 3: 1828899; TempCo: X7R; Supplier 3: Farnell; Published: 2008-06-19; RoHS: Y; MountType: SMT; Supplier 1: Digi-Key; PackageReference: 0603; Tolerance_%: 10%; Cap_Case: 0603; Value2: 25V; CompType: Capacitor; LatestRevisionDate: 2017-03-09; PartNumber: GRM188R71E104KA01D; AEC Qualified: ?; ComponentLink1Description: Datasheet link; Supplier Part Number 1: 490-1524-1-ND; Technology: Ceramic; ValueDisplayed: 0.1uF; ComponentLink1URL: http://search.murata.co.jp/Ceramy/PnsearchViewAction.do?HnOFG=ON&HnNFG=ON&SEL_CNT=50&sLang=en&sKey=GRM188R71E104KA01D&x=9&y=9&search=startwith
C57 C62 = CMP-0007143-4: CAP, CERM, 0.01 uF, 50 V, +/- 10%, X7R, AEC-Q200 Grade 1, 0603; Manufacturer: MuRata; TaMin_C: -55°C; Polarized: N; SizeAreaWB_mm2: 4.68; Value1: Unknown; U/M: EA; Value: 0.01uF; TaMax_C: 125°C; SizeZ_mm: 1; SizeX_mm: 1.6; SizeY_mm: 0.8; SizeArea_mm2: 1.28; AEC Qualified: Y; AEC Category: Q200; Supplier Part Number 2: 45Y5166; Publisher: Texas Instruments; Supplier 2: Newark; Supplier Part Number 3: 81-GCM188R71H103KA7D; TempCo: X7R; Supplier 3: Mouser; Published: 2008-06-19; RoHS: Y; MountType: SMT; Supplier 1: Digi-Key; PackageReference: 0603; Tolerance_%: 10%; Cap_Case: 0603; Value2: 50V; CompType: Capacitor; LatestRevisionDate: 2017-03-09; PartNumber: GCM188R71H103KA37D; ComponentLink1Description: Datasheet link; AEC Grade: 1; Supplier Part Number 1: 490-4778-1-ND; Technology: Ceramic; ValueDisplayed: 0.01uF; ComponentLink1URL: http://psearch.en.murata.com/capacitor/product/GCM188R71H103KA37%23.pdf
C58 C69 = CMP-0007073-4: CAP, CERM, 47 pF, 50 V, +/- 5%, C0G/NP0, AEC-Q200 Grade 1, 0603; Manufacturer: TDK; TaMin_C: -55°C; Polarized: N; SizeAreaWB_mm2: 4.68; Value1: Unknown; U/M: EA; Value: 47pF; TaMax_C: 125°C; SizeZ_mm: 1; SizeX_mm: 1.6; SizeY_mm: 0.8; Value2: 50V; SizeArea_mm2: 1.28; AEC Qualified: Y; AEC Category: Q200; Supplier Part Number 2: 04X3153; Publisher: Texas Instruments; Supplier 2: Newark; Supplier Part Number 3: 810-CGA3E2C0G1H470J; TempCo: C0G/NP0; Supplier 3: Mouser; Published: 2008-06-19; RoHS: Y; MountType: SMT; Supplier 1: Digi-Key; PackageReference: 0603; Tolerance_%: 5%; Cap_Case: 0603; CompType: Capacitor; LatestRevisionDate: 2017-03-09; PartNumber: CGA3E2C0G1H470J080AA; Cap_F: 47pF; VDC_V: 50V; ComponentLink1Description: Datasheet link; AEC Grade: 1; Supplier Part Number 1: 445-5636-1-ND; Technology: Ceramic; ComponentLink1URL: https://product.tdk.com/info/en/catalog/datasheets/mlcc_automotive_general_en.pdf
C63 C68 = CMP-0007255-1: CAP, CERM, 22 pF, 100 V, +/- 5%, C0G/NP0, 0603; Manufacturer: MuRata; TaMin_C: -55°C; Polarized: N; SizeAreaWB_mm2: 4.68; Value1: Unknown; U/M: EA; Value: 22pF; TaMax_C: 125°C; SizeZ_mm: 1; SizeX_mm: 1.6; SizeY_mm: 0.8; Value2: 100V; SizeArea_mm2: 1.28; AEC Category: Q200; ComponentLink1URL: http://search.murata.co.jp/Ceramy/PnsearchViewAction.do?HnOFG=ON&HnNFG=ON&SEL_CNT=50&sLang=en&sKey=GRM1885C2A220JA01D&x=9&y=9&search=startwith; Supplier Part Number 2: 81-GRM1885C2A220JA01; Publisher: Texas Instruments; Supplier 2: Mouser; TempCo: C0G/NP0; Published: 2008-06-19; RoHS: Y; MountType: SMT; Supplier 1: Digi-Key; PackageReference: 0603; Tolerance_%: 5%; Cap_Case: 0603; CompType: Capacitor; LatestRevisionDate: 2017-03-09; AEC Qualified: ?; Cap_F: 22pF; VDC_V: 100V; ComponentLink1Description: Datasheet link; Supplier Part Number 1: 490-1335-1-ND; PartNumber: GRM1885C2A220JA01D; Technology: Ceramic
C64 C67 = CMP-0007470-5: CAP, CERM, 0.1 uF, 100 V, +/- 10%, X7R, 0603; Manufacturer: MuRata; TaMin_C: -55°C; Polarized: N; SizeAreaWB_mm2: 4.68; Value1: Unknown; U/M: EA; Value: 0.1uF; TaMax_C: 125°C; SizeZ_mm: 1; SizeX_mm: 1.6; SizeY_mm: 0.8; SizeArea_mm2: 1.28; AEC Category: Q200; Supplier Part Number 2: 81-GRM188R72A104KA5J; Publisher: Texas Instruments; Supplier 2: Mouser; TempCo: X7R; Published: 2008-06-19; RoHS: Y; MountType: SMT; Supplier 1: Digi-Key; PackageReference: 0603; Tolerance_%: 10%; Cap_Case: 0603; Value2: 100V; CompType: Capacitor; LatestRevisionDate: 2017-03-09; PartNumber: GRM188R72A104KA35J; AEC Qualified: ?; ComponentLink1Description: Datasheet link; Supplier Part Number 1: 490-6439-1-ND; Technology: Ceramic; ValueDisplayed: 0.1uF; ComponentLink1URL: http://search.murata.co.jp/Ceramy/image/img/A01X/G101/ENG/GRM188R72A104KA35-01.pdf
C70 = CMP-0079247-1: CAP, CERM, 4700 pF, 100 V,+/- 10%, X7R, AEC-Q200 Grade 1, 0603; Manufacturer: MuRata; Cap_F: 4.7nF; SizeAreaWB_mm2: 4.68; SizeArea_mm2: 1.28; AEC Qualified: Y; AEC Category: Q200; Value: 4700pF; TaMax_C: 125°C; SizeZ_mm: 1; Polarized: N; TaMin_C: -55°C; VDC_V: 100V; SizeY_mm: 0.8; U/M: EA; SizeX_mm: 1.6; ComponentLink1Description: Datasheet link; RoHS: Y; Supplier Part Number 3: 81-GCM188R72A472K37D; Tolerance_%: 10%; Supplier 1: Digi-Key; PackageReference: 0603; Technology: Ceramic; PartNumber: GCM188R72A472KA37D; TempCo: X7R; Supplier Part Number 2: 06AC6010; Supplier 2: Newark; AEC Grade: 1; Value2: 100V; ComponentLink1URL: http://search.murata.co.jp/Ceramy/image/img/A01X/G101/ENG/GCM188R72A472KA37-01.pdf; CompType: Capacitor; MountType: SMT; Supplier Part Number 1: 490-4930-1-ND; Supplier 3: Mouser; Cap_Case: 0603
J15 = CMP-0054796-2: Header, 2.54 mm, 3x1, Gold, TH; Manufacturer: Wurth Elektronik; Pitch_mm: 2.54; Green_Lifecycle: Active; Cert_UL: Y; Shrouded: N; Green_REACh: Passed; Gender: Male; Row_Count: 1; MountType: TH; Supplier Part Number 1: 732-5316-ND; PinCount: 3; Color: Black; ClassName: Header; Supplier Part Number 3: 356154; ContactFinish: Gold; ComponentLink1Description: Datasheet URL; ComponentLink1URL: http://katalog.we-online.de/em/datasheet/6130xx11121.pdf; PackageReference: Header, 2.54mm, 3x1, TH; Supplier Part Number 2: 20X0950; Green_EU RoHS-2: Incomplete; CompType: Header; Green_EU RoHS: Passed; Orientation: Vertical; RoHS: Y; PartNumber: 61300311121; Supplier 2: Newark; Supplier 1: Digi-Key; Supplier 3: Farnell
L8 L9 L11 = CMP-0003245-1: Ferrite Bead, 1000 ohm @ 100 MHz, 0.2 A, 0402; Manufacturer: Wurth Elektronik; Ztyp@1GHz_Ohm: 293.136; ZTyp@100MHz_Ohm: 1k; SizeAreaWB_mm2: 3; DCR_ohm: 1.5; Value1: 1.5 ohm; Imax_A: 200mA; SizeZ_mm: 0.6; SizeX_mm: 1; SizeY_mm: 0.5; Value2: 0.2A; ComponentLink1URL: http://katalog.we-online.de/pbs/datasheet/742792796.pdf; Supplier Part Number 2: 710-742792796; Publisher: Texas Instruments; Supplier 2: Mouser; Published: 2014-04-30; RoHS: Y; MountType: SMT; Value: 1000 ohm; Supplier 1: Digi-Key; PackageReference: 0402; SizeArea_mm2: 0.5; CompType: Ferrite Bead; LatestRevisionDate: 2017-03-09; PartNumber: 742792796; ComponentLink1Description: Datasheet link; Supplier Part Number 1: 732-2132-1-ND; ValueDisplayed: 1000 ohm
L10 L13 = CMP-0058648-1: Inductor, Multilayer, Air Core, 120 nH, 0.15 A, 1.3 ohm, SMD; Manufacturer: MuRata; Isat: 0.15A @ % inductance drop; Irms: 0.15A @ C rise; Green_Lifecycle: Active; SizeAreaWB_mm2: 3; DCR_ohm: 1.3; Green_REACh: Passed; Value1: 1.3 ohm; Value: 120nH; Imax_A: 150mA; SizeZ_mm: 0.55; SizeX_mm: 1; SizeY_mm: 0.5; Value2: 0.15A; AEC Category: Q200; ComponentLink1URL: http://search.murata.co.jp/Ceramy/image/img/PDF/ENG/L0075S0083LQG15HS.pdf; Supplier Part Number 2: 81-LQG15HSR12J02D; Publisher: Texas Instruments; Supplier 2: Mouser; Published: 2008-06-26; RoHS: Y; Material: Air Core; MountType: SMT; Green_EU RoHS-2: Incomplete; Supplier 1: Digi-Key; Green_EU RoHS: Passed; PackageReference: 0402 polarized; SizeArea_mm2: 0.5; CompType: Inductor; Ind_H: 120nH; LatestRevisionDate: 2017-06-02; PartNumber: LQG15HSR12J02D; AEC Qualified: ?; ComponentLink1Description: Datasheet link; Supplier Part Number 1: 490-2636-1-ND; Technology: Multilayer
L12 = CMP-0087001-1: 200µH @ 100kHz 2 Line Common Mode Choke Surface Mount 70mA DCR 4.8 Ohm; Manufacturer: Murata; AEC Grade: Grade 1; AEC Qualified: Yes; SizeZ_mm: 2.5mm; PartNumber: DLW32MH201XK2; ComponentLink1Description: Datasheet; Symbol Name: SYM-DLW32MH201XK2; RoHS: TRUE; PackageReference: 1210; ComponentLink1URL: https://www.murata.com/en-sg/products/productdata/8801029685278/QFLC9124.pdf?1544104811000
R87 R93 = CMP-0022968-4: RES, 27.0, 1%, 0.1 W, 0603; Manufacturer: Yageo; Power_W: 100mW; TempCo: 100 ppm/C; Value_Code: 27R0; Value: 27.0; Res_ohm: 27; SizeX_mm: 1.6; SizeY_mm: 0.8; SizeZ_mm: 1; Value2: 0.1W; SizeArea_mm2: 1.28; AEC Qualified: N; VDC_V: 75V; AEC Category: Q200; SizeAreaWB_mm2: 4.68; ComponentLink1URL: http://www.yageo.com/pdf/Pu-RC0603_51_PbFree_L_2.pdf; Supplier Part Number 2: 603-RC0603FR-0727RL; Supplier 2: Mouser; Supplier Part Number 3: 9238298; Supplier 3: Farnell; RoHS: Y; Value1: 1%; MountType: SMT; Supplier 1: Digi-Key; PackageReference: 0603; Tolerance_%: 1%; CompType: Resistor; PartNumber: RC0603FR-0727RL; ComponentLink1Description: Datasheet link; Supplier Part Number 1: 311-27.0HRCT-ND; Technology: Thick Film; AEC Grade: N/A
R88-R91 = CMP-0026237-2: as R50-R56 on sheet T1_Data_Top_Level; ComponentLink1URL: http://www.vishay.com/docs/20035/dcrcwe3.pdf; Supplier Part Number 2: 52K6803; Supplier 2: Newark; Supplier Part Number 3: 71-CRCW0402-2.49K-E3; Supplier 3: Mouser; RoHS: E; Value1: 1%; MountType: SMT; Supplier 1: Digi-Key; PackageReference: 0402; Tolerance_%: 1%; Res_ohm: 2.49k; SizeArea_mm2: 0.5; CompType: Resistor; PartNumber: CRCW04022K49FKED; ComponentLink1Description: Datasheet link; Supplier Part Number 1: 541-2.49KLCT-ND; Technology: Thick Film
R92 = CMP-0026822-2: as R49 on sheet T1_Data_Top_Level; Supplier Part Number 2: 52K6543; Publisher: Texas Instruments; Supplier 2: Newark; Supplier Part Number 3: 71-CRCW0402-0-E3; Supplier 3: Mouser; Published: 2008-06-26; RoHS: Y; Value1: 5%; MountType: SMT; Supplier 1: Digi-Key; PackageReference: 0402; Tolerance_%: 5%; Res_ohm: 0; SizeArea_mm2: 0.5; CompType: Resistor; LatestRevisionDate: 2017-03-09; PartNumber: CRCW04020000Z0ED; AEC Qualified: ?; ComponentLink1Description: Datasheet link; Supplier Part Number 1: 541-0.0JCT-ND; Technology: Thick Film; ComponentLink1URL: http://www.vishay.com/docs/20035/dcrcwe3.pdf
R94 R98-R104 = CMP-0026880-3: RES, 22, 5%, 0.063 W, AEC-Q200 Grade 0, 0402; Manufacturer: Vishay-Dale; Power_W: 63mW; TempCo: 200 ppm/C; Value_Code: 22R0; Value: 22; EIA_Code: E24; SizeX_mm: 1; SizeY_mm: 0.5; SizeZ_mm: 0.6; Value2: 0.063W; AEC Qualified: Y; VDC_V: 50V; AEC Category: Q200; AEC Grade: 0; Supplier Part Number 2: 59M6716; Supplier 2: Newark; Supplier Part Number 3: 71-CRCW0402J-22-E3; Supplier 3: Mouser; RoHS: E; Value1: 5%; MountType: SMT; Supplier 1: Digi-Key; PackageReference: 0402; Tolerance_%: 5%; Res_ohm: 22; SizeArea_mm2: 0.5; CompType: Resistor; PartNumber: CRCW040222R0JNED; ComponentLink1Description: Datasheet link; Supplier Part Number 1: 541-22JCT-ND; Technology: Thick Film; ComponentLink1URL: http://www.vishay.com/docs/20035/dcrcwe3.pdf
R95 R96 = CMP-0022109-5: RES, 1.00 k, 1%, 0.1 W, AEC-Q200 Grade 0, 0603; Manufacturer: Vishay-Dale; Power_W: 100mW; TempCo: 100 ppm/C; Value_Code: 1k00; Value: 1.00k; EIA_Code: E96; Res_ohm: 1k; SizeX_mm: 1.6; SizeY_mm: 0.8; SizeZ_mm: 1; Value2: 0.1W; SizeArea_mm2: 1.28; AEC Qualified: Y; VDC_V: 75V; AEC Category: Q200; AEC Grade: 0; Supplier Part Number 2: 52K8015; Supplier 2: Newark; Supplier Part Number 3: 71-CRCW0603-1.0K-E3; Supplier 3: Mouser; RoHS: E; Value1: 1%; MountType: SMT; Supplier 1: Digi-Key; PackageReference: 0603; Tolerance_%: 1%; CompType: Resistor; PartNumber: CRCW06031K00FKEA; ComponentLink1Description: Datasheet link; Supplier Part Number 1: 541-1.00KHCT-ND; Technology: Thick Film; ComponentLink1URL: http://www.vishay.com/docs/20035/dcrcwe3.pdf
R97 = CMP-0016568-3: RES, 100 k, 1%, 0.25 W, AEC-Q200 Grade 0, 1206; Manufacturer: Vishay-Dale; Power_W: 250mW; TempCo: 100 ppm/C; Value: 100k; EIA_Code: E96; SizeX_mm: 3.2; SizeY_mm: 1.6; SizeZ_mm: 1.35; Value2: 0.25W; SizeArea_mm2: 5.12; AEC Qualified: Y; VDC_V: 200V; AEC Category: Q200; AEC Grade: 0; Supplier Part Number 2: 53K1920; Supplier 2: Newark; Supplier Part Number 3: 71-CRCW1206-100K-E3; Supplier 3: Mouser; Value_Code: 100k; RoHS: E; Value1: 1%; MountType: SMT; Supplier 1: Digi-Key; PackageReference: 1206; Tolerance_%: 1%; Res_ohm: 100k; CompType: Resistor; PartNumber: CRCW1206100KFKEA; ComponentLink1Description: Datasheet link; Supplier Part Number 1: 541-100KFCT-ND; Technology: Thick Film; ComponentLink1URL: http://www.vishay.com/docs/20035/dcrcwe3.pdf
TP9-TP15 = CMP-0078143-1: TEST POINT.  No entry in BOM.; CompType: Testpoint; PackageReference: N/A; Library Reference: TESTPOINT; Manufacturer: N/A; PartNumber: N/A
U13 = CMP-0013881-3: DP83TC811Q1, RND0036A (VQFNP-36); Manufacturer: Texas Instruments; SizeZ_mm: 0.9; SizeX_mm: 6; SizeArea_mm2: 36; CompType: IC; U/M: EA; SizeAreaWB_mm2: 64; ComponentLink1URL: https://sps06.itg.ti.com/sites/KMS/crossdivteams/altium/docs/ComponentDatasheets/DP83TC811PrelimFootprint.pdf; SizeY_mm: 6; PackageDescription: VQFNP-36; Publisher: Texas Instruments; PackageReference: RND0036A; LatestRevisionDate: 2017-03-09; PartNumber: DP83TC811RNDQ1; ComponentLink1Description: Datasheet Link; MountType: SMT; Alternate Manufacturer: Texas Instruments
U14 = CMP-0073595-1: Automotive Dual-Channel High-Speed ESD Protection Device, DCK0003A (SOT-SC70-3); Alternate Manufacturer: Texas Instruments; SizeAreaWB_mm2: 9.3; U/M: EA; SizeZ_mm: 1.1; SizeX_mm: 2.1; SizeY_mm: 2.0; SizeArea_mm2: 4.2; CompType: IC; ComponentLink1URL: http://www.ti.com/lit/ds/symlink/tpd2e2u06-q1.pdf; Publisher: Texas Instruments; PackageDescription: SOT-SC70-3; RoHS: Y; Footprint Path 6: C:\AltiumLibraries\Footprints\TI\.PcbLib; MountType: SMT; Manufacturer: Texas Instruments; PackageReference: DCK0003A; LatestRevisionDate: 2017-06-09; PartNumber: TPD2E2U06QDCKRQ1; ComponentLink1Description: Datasheet Link

## Sheet Hardware.SchDoc
size 431 x 279 mm; Date: Not shown in title block; ApprovedBy: Not shown in title block; CheckedBy: Not shown in title block; Author: Not shown in title block; CompanyName: Not shown in title block; DrawnBy: Andy Lin (TI); Engineer: Not shown in title block; Organization: Not shown in title block; Address1: Not shown in title block; Address2: Not shown in title block; Address3: Not shown in title block; Address4: Not shown in title block; DocumentNumber: 14; Revision: Use project parameter SCH_Rev; SheetNumber: 14; SheetTotal: 14; PageSetup: Record=PageOptions|CenterHorizontal=True|CenterVertical=True|PrintScale=1.00|XCorrection=1.00|YCorrection=1.00|PrintKind=0|BorderSize=5000000|LeftOffset=0|BottomOffset=0|Orientation=2|PaperLength=1000|PaperWidth=1000|Scale=100|PaperSource=15|PrintQuality=600|MediaType=1|DitherType=10|PaperKind=Letter|PrintScaleMode=1; CurrentTime: Not shown in title block; CurrentDate: Not shown in title block; Time: Not shown in title block; DocumentFullPathAndName: Not shown in title block; DocumentName: Not shown in title block; ModifiedDate: Not shown in title block; ImagePath: Not shown in title block
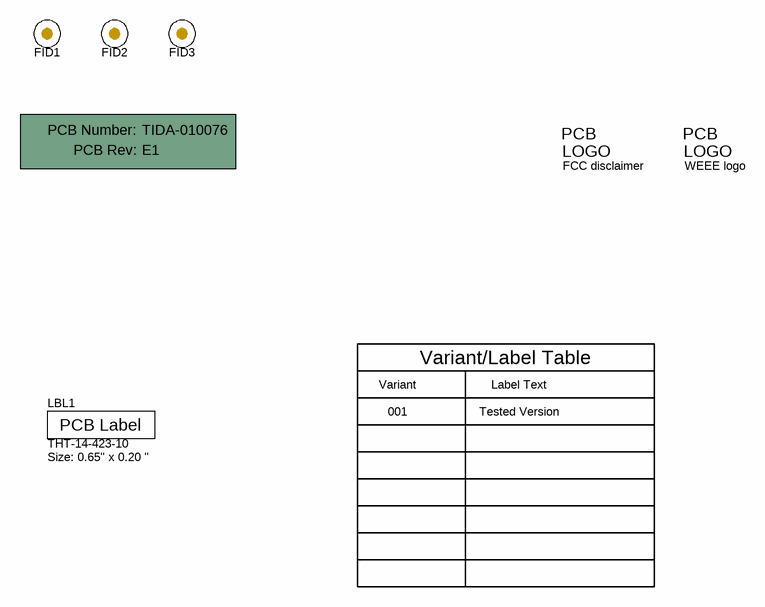
[diagram p13: Hardware.SchDoc]

### Parts
!PCB1  Printed Circuit Board  (value not drawn)  (mechanical)
FID1  Fiducial  [Fiducial10-20]  (value not drawn)
FID2  Fiducial  [Fiducial10-20]  (value not drawn)
FID3  Fiducial  [Fiducial10-20]  (value not drawn)
LBL1  THT-14-423-10  Note: Size: 0.65" x 0.20 "  [Label_650x200]
Logo3  FCC disclaimer  [FCC_disclaimer]  (no BOM)
Logo4  WEEE logo  [WEEE_Minimum]  (no BOM)

### Notes on the sheet
- Variant
- Variant/Label Table
- Label Text
- 001
- Tested Version
- Drawn By:
- SVN Rev:
- Number:
- TID #:
- Orderable:
- Rev:
- Sheet Title:
- File:
- Project Title:
- Designed for:
- Assembly Variant:
- Mod. Date:
- Sheet:
- Size:
- of
- B
- http://www.ti.com
- Texas Instruments and/or its licensors do not warrant the accuracy or completeness of this specification or any information contained therein. Texas Instruments and/or its licensors do not warrant that this design will meet the specifications, will be suitable for your application or fit for any particular purpose, or will operate in an implementation. Texas Instruments and/or its licensors do not warrant that the design is production worthy. You should completely validate and test your design implementation to confirm the system functionality for your application.
- Engineer:
- Contact:
- © Texas Instruments
- (in symbol CMP-0003618-2) PCB Number:; PCB Rev:
- (in symbol CMP-0003625-1) PCB Label
- (in symbol CMP-0074769-1) PCB; LOGO
- (in symbol CMP-0074847-1) PCB; LOGO

### Library data of the parts
!PCB1 = CMP-0003618-2: Manufacturer: Any; PartNumber: TIDA-010076; CompType: PCB; RoHS: O; MountType: N/A; Publisher: Texas Instruments; LatestRevisionDate: 2017-03-09; Key: PCB
FID1-FID3 = CMP-0077181-1: Fiducial mark.  There is nothing to buy or mount.; CompType: Fiducial; Manufacturer: N/A; MountType: N/A; PackageReference: N/A; PartNumber: N/A; ClassName: FiducialMark; Library Reference: Fiducial
LBL1 = CMP-0003625-1: Thermal Transfer Printable Labels, 0.650" W x 0.200" H - 10,000 per roll; Manufacturer: Brady; CompType: Label; ClassName: Label; PartNumber: THT-14-423-10; RoHS: Y; PackageReference: PCB Label 0.650 x 0.200 inch; MountType: N/A; ComponentLink1Description: Web Page; ComponentLink1URL: http://www.bradyid.com/bradyid/pdpv/THT-14-423-10.html; Publisher: Texas Instruments; LatestRevisionDate: 2017-03-09; Supplier 1: Newark; Supplier Part Number 1: 97C5133; Supplier 2: Farnell; Supplier Part Number 2: 2065596; Key: THT-14-423-10
Logo3 = CMP-0074847-1: FCC_disclaimer; Library Reference: Logo; Published: 2009-03-03; Publisher: Texas Instruments; LatestRevisionDate: 2017-07-06; Lib Reference: FCC_disclaimer; PartNumber: FCC disclaimer
Logo4 = CMP-0074769-1: Library Reference: WEEE logo; Lib Reference: WEEE logo; PartNumber: WEEE logo